# EAGLE schematic tc connecor test spacing 2 (EAGLE 6.5.0)
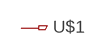
[diagram p0: schematic, sheet 1]

## Parts
U$1  TC-MINI-SINGLE  [TC-CLIP-SINGLE]
Unconnected: U$1.P$1

## Library data of the parts
U$1 = PaxInstruments-Connectors:TC-MINI-SINGLE